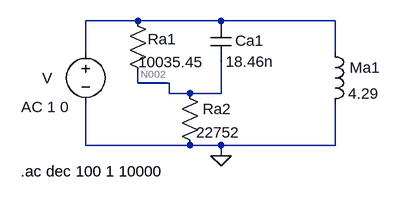
[diagram p0: schematic EA_PistaoCil.asc]
EA_PistaoCil.asc, the LTspice schematic file:
Version 4
SHEET 1 880 680
WIRE 352 96 272 96
WIRE 480 96 352 96
WIRE 656 96 480 96
WIRE 272 144 272 96
WIRE 656 144 656 96
WIRE 352 192 352 176
WIRE 400 192 352 192
WIRE 400 208 400 192
WIRE 432 208 400 208
WIRE 480 208 480 160
WIRE 480 208 432 208
WIRE 272 288 272 224
WIRE 432 288 272 288
WIRE 480 288 432 288
WIRE 656 288 656 224
WIRE 656 288 480 288
WIRE 480 304 480 288
FLAG 480 304 0
SYMBOL voltage 272 128 R0
WINDOW 123 -99 101 Left 2
WINDOW 39 0 0 Left 0
WINDOW 0 -67 56 Left 2
SYMATTR Value2 AC 1 0
SYMATTR InstName V
SYMATTR Value ""
SYMBOL res 336 80 R0
WINDOW 3 17 80 Left 2
WINDOW 0 31 44 Left 2
SYMATTR Value 10035.45
SYMATTR InstName Ra1
SYMBOL res 416 192 R0
WINDOW 3 26 76 Left 2
SYMATTR Value 22752
SYMATTR InstName Ra2
SYMBOL cap 464 96 R0
WINDOW 3 23 63 Left 2
WINDOW 0 38 31 Left 2
SYMATTR Value 18.46n
SYMATTR InstName Ca1
SYMBOL ind 640 128 R0
WINDOW 0 38 40 Left 2
SYMATTR InstName Ma1
SYMATTR Value 4.29
TEXT 172 328 Left 2 !.ac dec 100 1 10000

The netlist it stands for:
* EA_PistaoCil.asc
V N001 0 AC 1 0
Ra1 N001 N002 10035.45
Ra2 N002 0 22752
Ca1 N001 N002 18.46n
L§Ma1 N001 0 4.29
.ac dec 100 1 10000
.backanno
.end

* Results of the author's LTspice run, read from the files saved beside the schematic
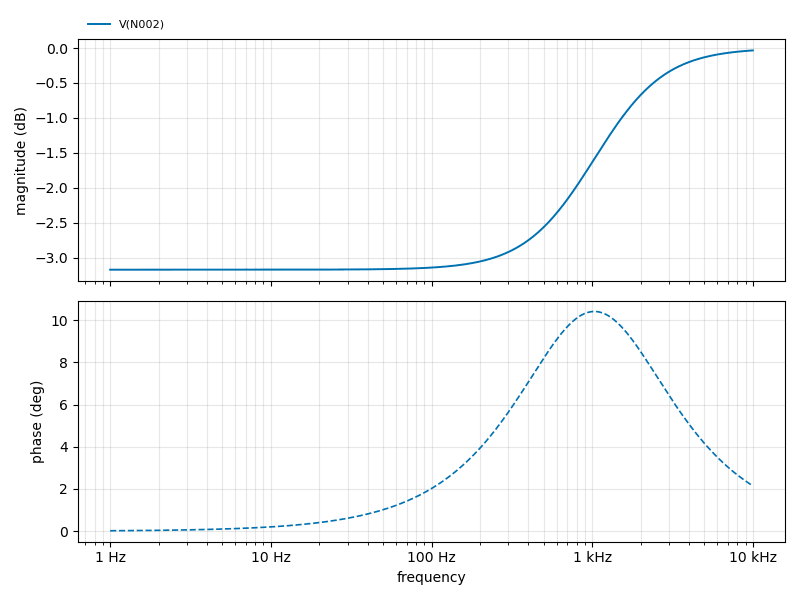
[diagram p1: AC Analysis of EA_PistaoCil.asc, plotted from the saved traces]
* AC Analysis, 1 run:
*   V(N002): -3.17 dB at 1 Hz, -0.03 dB at 10 kHz, peak -0.03 dB at 10 kHz, 3 dB below the peak at 210.4 Hz